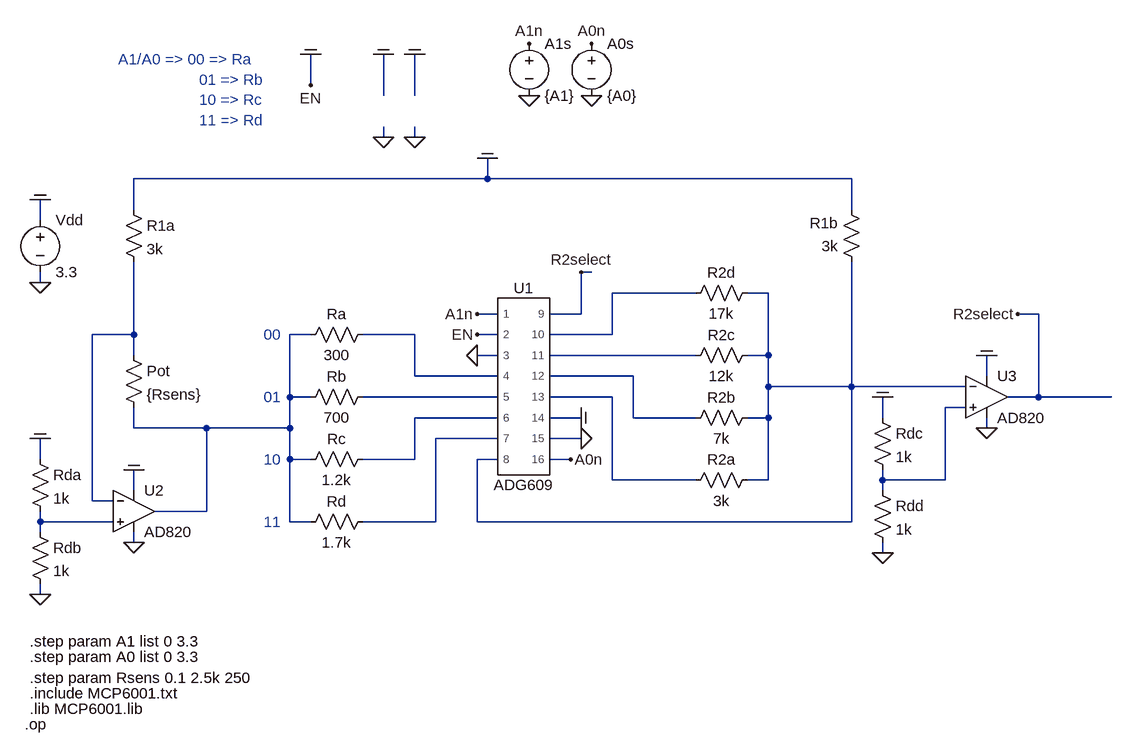
[diagram p0: schematic AutoRanging.asc]
AutoRanging.asc, the LTspice schematic file:
Version 4
SHEET 1 1828 680
WIRE 496 -384 496 -432
WIRE 608 -368 608 -432
WIRE 656 -368 656 -432
WIRE 608 -304 608 -320
WIRE 656 -304 656 -320
WIRE 768 -240 768 -272
WIRE 768 -240 224 -240
WIRE 1328 -240 768 -240
WIRE 224 -192 224 -240
WIRE 1328 -192 1328 -240
WIRE 80 -176 80 -208
WIRE 928 -96 912 -96
WIRE 80 -80 80 -96
WIRE 1088 -64 960 -64
WIRE 1200 -64 1168 -64
WIRE 784 -32 752 -32
WIRE 912 -32 912 -96
WIRE 912 -32 864 -32
WIRE 1616 -32 1584 -32
WIRE 224 0 224 -112
WIRE 224 0 160 0
WIRE 496 0 464 0
WIRE 656 0 576 0
WIRE 784 0 752 0
WIRE 960 0 960 -64
WIRE 960 0 864 0
WIRE 224 32 224 0
WIRE 784 32 752 32
WIRE 1088 32 864 32
WIRE 1200 32 1200 -64
WIRE 1200 32 1168 32
WIRE 656 64 656 0
WIRE 784 64 656 64
WIRE 992 64 864 64
WIRE 1536 64 1536 32
WIRE 1200 80 1200 32
WIRE 1328 80 1328 -112
WIRE 1328 80 1200 80
WIRE 1504 80 1328 80
WIRE 464 96 464 0
WIRE 496 96 464 96
WIRE 784 96 576 96
WIRE 960 96 864 96
WIRE 1616 96 1616 -32
WIRE 1616 96 1568 96
WIRE 1728 96 1616 96
WIRE 1504 112 1472 112
WIRE 784 128 656 128
WIRE 912 128 864 128
WIRE 992 128 992 64
WIRE 1088 128 992 128
WIRE 1200 128 1200 80
WIRE 1200 128 1168 128
WIRE 1376 128 1376 96
WIRE 224 144 224 112
WIRE 336 144 224 144
WIRE 464 144 464 96
WIRE 464 144 336 144
WIRE 1536 144 1536 128
WIRE 784 160 688 160
WIRE 912 160 864 160
WIRE 80 192 80 160
WIRE 464 192 464 144
WIRE 496 192 464 192
WIRE 656 192 656 128
WIRE 656 192 576 192
WIRE 784 192 752 192
WIRE 896 192 864 192
WIRE 960 224 960 96
WIRE 1088 224 960 224
WIRE 1200 224 1200 128
WIRE 1200 224 1168 224
WIRE 1376 224 1376 208
WIRE 1472 224 1472 112
WIRE 1472 224 1376 224
WIRE 224 240 224 208
WIRE 1376 240 1376 224
WIRE 160 256 160 0
WIRE 192 256 160 256
WIRE 336 272 336 144
WIRE 336 272 256 272
WIRE 80 288 80 272
WIRE 192 288 80 288
WIRE 464 288 464 192
WIRE 496 288 464 288
WIRE 688 288 688 160
WIRE 688 288 576 288
WIRE 752 288 752 192
WIRE 1328 288 1328 80
WIRE 1328 288 752 288
WIRE 80 304 80 288
WIRE 224 320 224 304
WIRE 1376 336 1376 320
WIRE 80 400 80 384
FLAG 752 0 EN
FLAG 752 32 0
FLAG 912 128 COM
FLAG 912 160 0
FLAG 1376 336 0
FLAG 1376 96 COM
FLAG 1536 144 0
FLAG 1536 32 COM
FLAG 224 320 0
FLAG 224 208 COM
FLAG 80 400 0
FLAG 80 160 COM
FLAG 496 -384 EN
FLAG 496 -432 COM
FLAG 80 -208 COM
FLAG 80 -80 0
FLAG 608 -432 COM
FLAG 656 -432 COM
FLAG 608 -304 0
FLAG 768 -272 COM
FLAG 912 -96 R2select
FLAG 1584 -32 R2select
FLAG 832 -368 0
FLAG 928 -368 0
FLAG 752 -32 A1n
FLAG 896 192 A0n
FLAG 656 -304 0
FLAG 832 -448 A1n
FLAG 928 -448 A0n
DATAFLAG 1712 96 ""
SYMBOL AutoGenerated\\ADG609 816 80 R0
SYMATTR InstName U1
SYMBOL res 208 -208 R0
SYMATTR InstName R1a
SYMATTR Value 3k
SYMBOL res 1344 -96 R180
WINDOW 0 36 76 Left 2
WINDOW 3 36 40 Left 2
SYMATTR InstName R1b
SYMATTR Value 3k
SYMBOL res 1360 112 R0
SYMATTR InstName Rdc
SYMATTR Value 1k
SYMBOL res 1360 224 R0
SYMATTR InstName Rdd
SYMATTR Value 1k
SYMBOL res 1184 208 R90
WINDOW 0 0 56 VBottom 2
WINDOW 3 32 56 VTop 2
SYMATTR InstName R2a
SYMATTR Value 3k
SYMBOL res 64 176 R0
SYMATTR InstName Rda
SYMATTR Value 1k
SYMBOL res 64 288 R0
SYMATTR InstName Rdb
SYMATTR Value 1k
SYMBOL res 208 16 R0
SYMATTR InstName Pot
SYMATTR Value {Rsens}
SYMBOL voltage 80 -192 R0
SYMATTR InstName Vdd
SYMATTR Value 3.3
SYMBOL res 592 -16 R90
WINDOW 0 0 56 VBottom 2
WINDOW 3 32 56 VTop 2
SYMATTR InstName Ra
SYMATTR Value 300
SYMBOL res 592 80 R90
WINDOW 0 0 56 VBottom 2
WINDOW 3 32 56 VTop 2
SYMATTR InstName Rb
SYMATTR Value 700
SYMBOL res 592 176 R90
WINDOW 0 0 56 VBottom 2
WINDOW 3 32 56 VTop 2
SYMATTR InstName Rc
SYMATTR Value 1.2k
SYMBOL res 592 272 R90
WINDOW 0 0 56 VBottom 2
WINDOW 3 32 56 VTop 2
SYMATTR InstName Rd
SYMATTR Value 1.7k
SYMBOL OpAmps\\AD820 224 208 R0
SYMATTR InstName U2
SYMBOL OpAmps\\AD820 1536 32 R0
SYMATTR InstName U3
SYMBOL res 1184 112 R90
WINDOW 0 0 56 VBottom 2
WINDOW 3 32 56 VTop 2
SYMATTR InstName R2b
SYMATTR Value 7k
SYMBOL res 1184 16 R90
WINDOW 0 0 56 VBottom 2
WINDOW 3 32 56 VTop 2
SYMATTR InstName R2c
SYMATTR Value 12k
SYMBOL res 1184 -80 R90
WINDOW 0 0 56 VBottom 2
WINDOW 3 32 56 VTop 2
SYMATTR InstName R2d
SYMATTR Value 17k
SYMBOL voltage 832 -464 R0
SYMATTR InstName A1s
SYMATTR Value {A1}
SYMBOL voltage 928 -464 R0
SYMATTR InstName A0s
SYMATTR Value {A0}
TEXT 64 552 Left 2 !.include MCP6001.txt
TEXT 64 576 Left 2 !.lib MCP6001.lib
TEXT 56 600 Left 2 !.op
TEXT 200 -424 Left 2 ;A1/A0 => 00 => Ra\n                  01 => Rb\n                  10 => Rc\n                  11 => Rd
TEXT 424 0 Left 2 ;00
TEXT 424 96 Left 2 ;01
TEXT 424 192 Left 2 ;10
TEXT 424 288 Left 2 ;11
TEXT 64 528 Left 2 !.step param Rsens 0.1 2.5k 250
TEXT 64 472 Left 2 !.step param A1 list 0 3.3
TEXT 64 496 Left 2 !.step param A0 list 0 3.3

The netlist it stands for:
* AutoRanging.asc
XU1 A1n COM 0 N005 N008 N011 N012 N002 R2select N001 N006 N007 N009 COM 0 A0n ADG609  ; pins 1 2 3 4 5 6 7 8 9 10 11 12 13 14 15 16
R1a COM N003 3k
R1b N002 COM 3k
Rdc COM N010 1k
Rdd N010 0 1k
R2a N002 N009 3k
Rda COM N013 1k
Rdb N013 0 1k
R§Pot N003 N004 {Rsens}
Vdd COM 0 3.3
Ra N005 N004 300
Rb N008 N004 700
Rc N011 N004 1.2k
Rd N012 N004 1.7k
XU2 N013 N003 COM 0 N004 AD820  ; pins In+ In- V+ V- OUT
XU3 N010 N002 COM 0 R2select AD820  ; pins In+ In- V+ V- OUT
R2b N002 N007 7k
R2c N002 N006 12k
R2d N002 N001 17k
V§A1s A1n 0 {A1}
V§A0s A0n 0 {A0}
.include MCP6001.txt
.lib MCP6001.lib
.op
* A1/A0 => 00 => Ra
*                   01 => Rb
*                   10 => Rc
*                   11 => Rd
* 00
* 01
* 10
* 11
.step param Rsens 0.1 2.5k 250
.step param A1 list 0 3.3
.step param A0 list 0 3.3
.lib C:\Users\zacha\Desktop\MyFiles\Research Project\LTSpice\All_Models\adg609.cir
.backanno
.end